# EasyEDA Pro project 第十届农装PCB工程.epro, board 摄像头板_2024_9
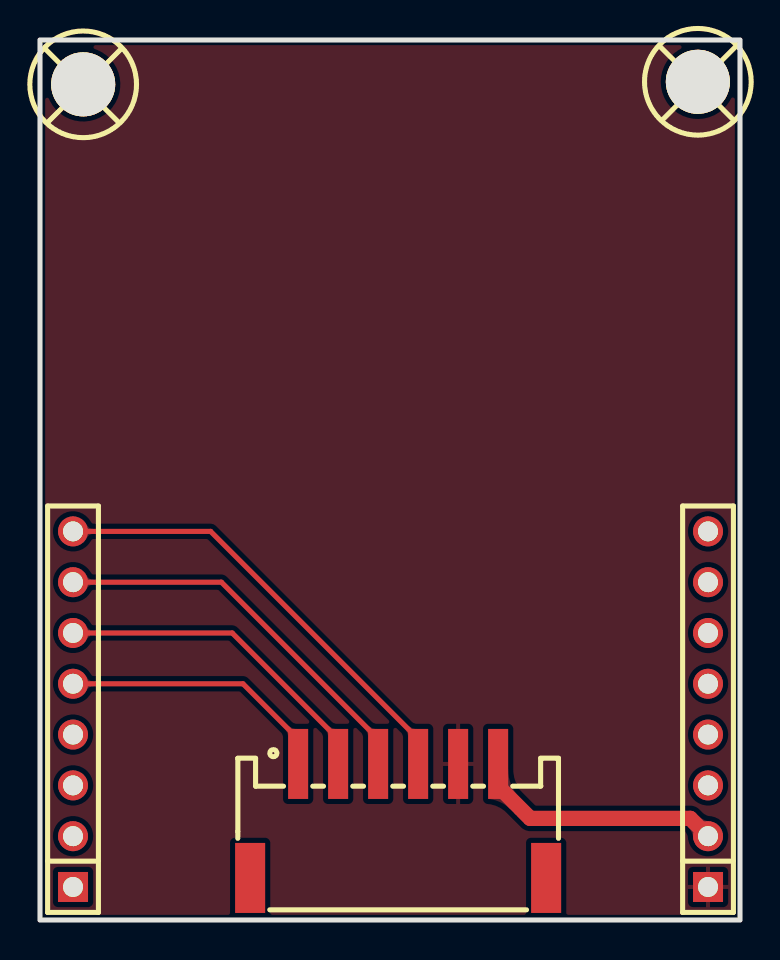
[diagram p9: board, top side]
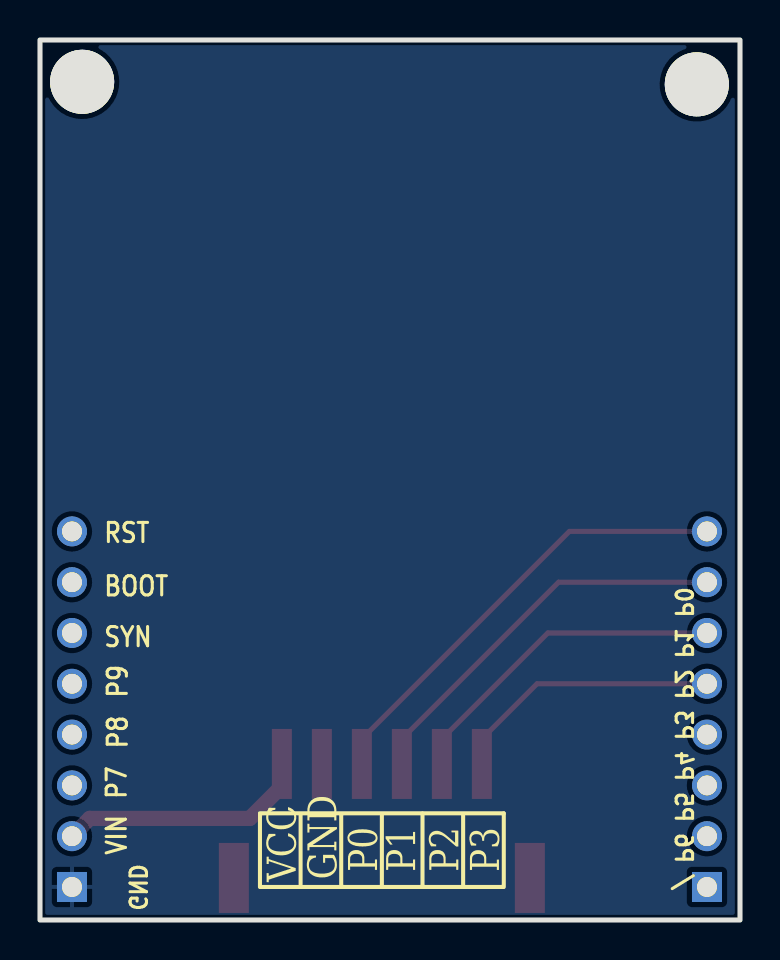
[diagram p10: board, bottom side, seen from below]

Outline 35 x 44 mm; copper layers: Top Layer, Bottom Layer. Coordinates in mm from the lower left corner of the outline.
Outline path: rectangle 0,44 35,0
Stack: Top Layer 0.035mm / Dielectric1 1.51mm FR4 er 4.5 / Bottom Layer 0.035mm

## Design rules (mm)
template: JLCPCB Capability(Two Layers Board)
spacing copperThickness1oz (default): track to track 0.102, other pairs 0.152 to 0.3
spacing copperThickness2oz: track to track 0.203, other pairs 0.152 to 0.3
track width copperThickness1oz (default): min 0.127, default 0.254, max 2.54
track width copperThickness2oz: min 0.203, default 0.254, max 2.54
differential pair differentialPair (default): width min 0.127, default 0.254, max 2.54; gap min 0.152, default 0.152
via viaSize (default): diameter min 0.5, default 0.61, max 10; hole min 0.3, default 0.305, max 6.3

## Placement (name value [footprint] x y rotation side)
/ P6 P5 P4 P3 P2 P1 P0  PZ254V-11-08P  [HDR-TH_8P-P2.54-V-M]  1.65 10.54 90 top
GND  PZ254V-11-08P  [HDR-TH_8P-P2.54-V-M]  33.4 10.54 90 top
TP1  -  [M3螺丝]  32.96 41.85 0 top
TP1#2  -  [M3螺丝]  2.22 41.72 0 top
U1  ZX-PH2.0-WT6P  [CONN-SMD_6P-P2.00_ZX-PH2.0-WT6P]  17.91 4.95 0 top

## Footprints (pads in the part's own frame, mm; a bottom-side part is the same pattern mirrored in y, then rotated)
CONN-SMD_6P-P2.00_ZX-PH2.0-WT6P
  rect 1x3.5 smd: 1(-5,2.85) 2(-3,2.85) 3(-1,2.85) 4(1,2.85) 5(3,2.85) 6(5,2.85)
  rect 1.5x3.5 smd: 7(7.4,-2.85) 8(-7.4,-2.85)
HDR-TH_8P-P2.54-V-M
  rect 1.5x1.5 hole 1: 1(-8.89,0)
  round 1.5 hole 1: 2(-6.35,0) 3(-3.81,0) 4(-1.27,0) 5(1.27,0) 6(3.81,0) 7(6.35,0) 8(8.89,0)
M3螺丝
  round 3.2 hole 3.2: 1(-0.064,0.064)

## Nets
3.3V: / P6 P5 P4 P3 P2 P1 P0.1
GND: GND.1 U1.5
VIN: GND.2 U1.6
BOOT: GND.7
P0: / P6 P5 P4 P3 P2 P1 P0.8 U1.4
P1: / P6 P5 P4 P3 P2 P1 P0.7 U1.3
P2: / P6 P5 P4 P3 P2 P1 P0.6 U1.2
P3: / P6 P5 P4 P3 P2 P1 P0.5 U1.1
P4: / P6 P5 P4 P3 P2 P1 P0.4
P5: / P6 P5 P4 P3 P2 P1 P0.3
P6: / P6 P5 P4 P3 P2 P1 P0.2
P7: GND.3
P8: GND.4
P9: GND.5
RST: GND.8
SYN: GND.6

Pads without a net: TP1 1; TP1#2 1; U1 7 8

## Routing (per net, layer and track width the routed paths; a pad name or vN(x,y) marks a point on that pad's centre or on a via; arc(x,y) is an arc through that point)
VIN: length 12.6
  Top Layer w0.762: GND.2 32.51,5.08 24.51,5.08 22.91,6.68 U1.6
P0: length 22.8
  Top Layer w0.254: / P6 P5 P4 P3 P2 P1 P0.8 8.53,19.43 18.91,9.05 U1.4
P1: length 19.8
  Top Layer w0.254: U1.3 16.91,9.05 9.07,16.89 / P6 P5 P4 P3 P2 P1 P0.7
P2: length 16.7
  Top Layer w0.254: / P6 P5 P4 P3 P2 P1 P0.6 9.61,14.35 14.91,9.05 U1.2
P3: length 13.6
  Top Layer w0.254: U1.1 12.91,9.05 10.15,11.81 / P6 P5 P4 P3 P2 P1 P0.5

## Copper pours and planes (outline as drawn; the poured copper is in the pictures)
GND on Top Layer: -7.62,45.08 43.56,45.08 43.56,-0.89 -7.62,-0.89
GND on Bottom Layer: -3.43,48.64 35.18,48.64 35.18,-4.83 -3.43,-4.83

Small or netless copper shapes (teardrops, artwork), in the pictures only: 10 on Top Layer

## Text on the board
Bottom Silkscreen Layer: P9 | P8 | P7 | VIN | RST | BOOT | SYN | P3 | P2 | P1 | P0 | GND | VCC
